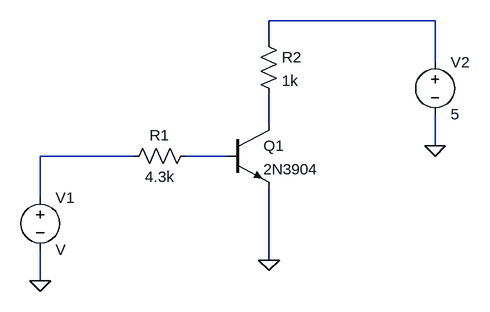
[diagram p0: schematic Draft3.asc]
Draft3.asc, the LTspice schematic file:
Version 4
SHEET 1 880 680
WIRE 592 32 336 32
WIRE 336 64 336 32
WIRE 592 96 592 32
WIRE 336 192 336 144
WIRE 592 224 592 176
WIRE 128 240 -16 240
WIRE 272 240 208 240
WIRE -16 304 -16 240
WIRE 336 400 336 288
WIRE -16 432 -16 384
FLAG 336 400 0
FLAG -16 432 0
FLAG 592 224 0
SYMBOL Voltage -16 288 R0
SYMATTR InstName V1
SYMBOL Res 224 224 R90
WINDOW 0 0 56 VBottom 2
WINDOW 3 32 56 VTop 2
SYMATTR InstName R1
SYMATTR Value 4.3k
SYMBOL Res 320 48 R0
SYMATTR InstName R2
SYMATTR Value 1k
SYMBOL Voltage 592 80 R0
SYMATTR InstName V2
SYMATTR Value 5
SYMBOL npn 272 192 R0
SYMATTR InstName Q1
SYMATTR Value 2N3904

The netlist it stands for:
* Draft3.asc
V1 N003 0 V
R1 N004 N003 4.3k
R2 N001 N002 1k
V2 N001 0 5
Q1 N002 N004 0 0 2N3904
.model NPN NPN
.model PNP PNP
.lib standard.bjt
.backanno
.end